# EAGLE design JACK_DUAL_M2 (EAGLE 9.6.2)
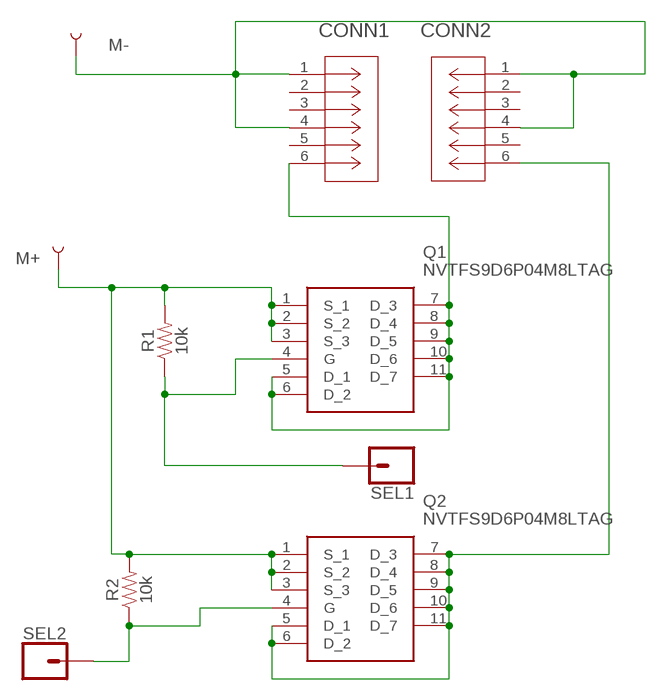
[diagram p0: schematic, sheet 1]

## Parts
CONN1  ACJS-MHDR  [CONN_MHDR_AMP]
CONN2  ACJS-MHDR  [CONN_MHDR_AMP]
M+  TEST-POINT3  [PAD.03X.03]
M-  TEST-POINT3  [PAD.03X.03]
Q1  NVTFS9D6P04M8LTAG  [NVTFS5124PLTWG]
Q2  NVTFS9D6P04M8LTAG  [NVTFS5124PLTWG]
R1  10k  RESISTOR0805  [0805]
R2  10k  RESISTOR0805  [0805]
SEL1  CONN_01  [1X01]
SEL2  CONN_01  [1X01]

## Nets
GND: CONN1.1 CONN1.4 CONN2.1 CONN2.4 M-.P$1
M+: M+.P$1 Q1.1(S_1) Q1.2(S_2) Q1.3(S_3) Q2.1(S_1) Q2.2(S_2) Q2.3(S_3) R1.2 R2.2
M+2: CONN2.6 Q2.5(D_1) Q2.6(D_2) Q2.7(D_3) Q2.8(D_4) Q2.9(D_5) Q2.10(D_6) Q2.11(D_7)
N$1: CONN1.6 Q1.5(D_1) Q1.6(D_2) Q1.7(D_3) Q1.8(D_4) Q1.9(D_5) Q1.10(D_6) Q1.11(D_7)
N$4: Q1.4(G) R1.1 SEL1.1
N$7: Q2.4(G) R2.1 SEL2.1
Unconnected: CONN1.2 CONN1.3 CONN1.5 CONN2.2 CONN2.3 CONN2.5

## Library data of the parts
CONN1 CONN2 = ACJSMHDR:ACJS-MHDR; BUILT_BY: EMA_Matt; COPYRIGHT: Copyright (C) 2018 Accelerated Designs. All rights reserved; MANUFACTURER_PART_NUMBER: ACJS-MHDR; SOURCELIBRARY: Amphenol_2019-10-30; VENDOR: Amphenol
M+ M- = SparkFun-Connectors:TEST-POINT: SparkFun Test Points Bare copper test points for troubleshooting or In-Circuit-Testing. These are used by our Production team for verifying production board runs using pogo-pins on test beds. SparkFun Products: SparkFun LSM9DS1 Breakout <https://www.sparkfun.com/products/13284> SparkFun PSOC <https://www.sparkfun.com/products/13714> SparkFun Load Cell Amplifier <https://www.sparkfun.com/products/13879>
Q1 Q2 = SamacSys_Parts:NVTFS9D6P04M8LTAG: MOSFET MV8 P INITIAL PROGRAM Source: Datasheet <https://www.onsemi.com/pub/Collateral/NVTFS9D6P04M8L-D.PDF>; DESCRIPTION: MOSFET MV8 P INITIAL PROGRAM; HEIGHT: 0.8mm; MANUFACTURER_NAME: ON Semiconductor; MANUFACTURER_PART_NUMBER: NVTFS9D6P04M8LTAG; MOUSER_PART_NUMBER: 863-NVTFS9D6P04M8LTG; MOUSER_PRICE-STOCK: https://www.mouser.co.uk/ProductDetail/ON-Semiconductor/NVTFS9D6P04M8LTAG/?qs=xZ%2FP%252Ba9zWqYALd8g5rll2Q%3D%3D
R1 R2 = SparkFun-Resistors:RESISTOR: Generic Resistor Package
SEL1 SEL2 = SparkFun-Connectors:CONN_01: Single connection point. Often used as Generic Header-pin footprint for 0.1 inch spaced/style header connections On any of the 0.1 inch spaced packages, you can populate with these: Break Away Headers - Straight <https://www.sparkfun.com/products/116> (PRT-00116) Break Away Male Headers - Right Angle <https://www.sparkfun.com/products/553> (PRT-00553) Female Headers <https://www.sparkfun.com/products/115> (PRT-00115) Break Away Headers - Machine Pin <https://www.sparkfun.com/products/117> (PRT-00117) Break Away Female Headers - Swiss Machine Pin <https://www.sparkfun.com/products/743> (PRT-00743) This device is also useful as a general connection point to wire up your design to another part of your project. Our various solder wires solder well into these plated through hole pads. Hook-Up Wire - Assortment (Stranded, 22 AWG) <https://www.sparkfun.com/products/11375> (PRT-11375) Hook-Up Wire - Assortment (Solid Core, 22 AWG) <https://www.sparkfun.com/products/11367> (PRT-11367) View the entire wire category on our website here <https://www.sparkfun.com/categories/141> Special notes: SMTSO-256-ET is a "flush mount" nut for a 4-40 screw. We mostly use this on specialty testbeds; it is a nice way to connect hardware to your PCB at an adjustable hieght. Also note, the SNAP packages are for using a snappable style connector. We sell a baggie of snaps and they are also used on two LilyPad designs: Snap Assortment - 30 pack (male and female) <https://www.sparkfun.com/products/11347> (DEV-11347) LilyPad Arduino SimpleSnap <https://www.sparkfun.com/products/10941> (DEV-10941) LilyPad SimpleSnap Protoboard <https://www.sparkfun.com/products/10940> (DEV-10940)

## Board
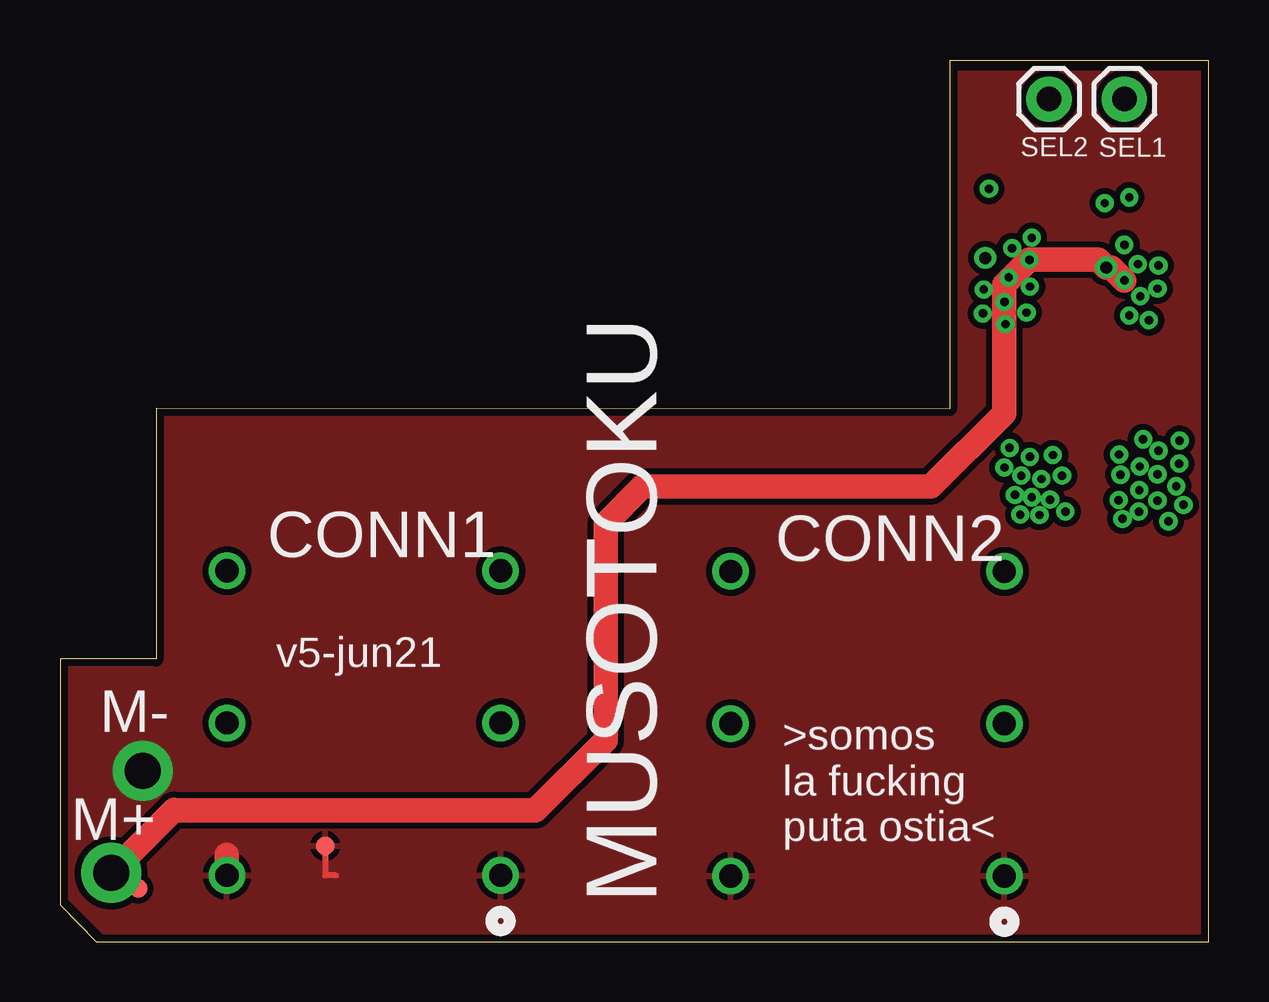
[diagram p1: board, top side]
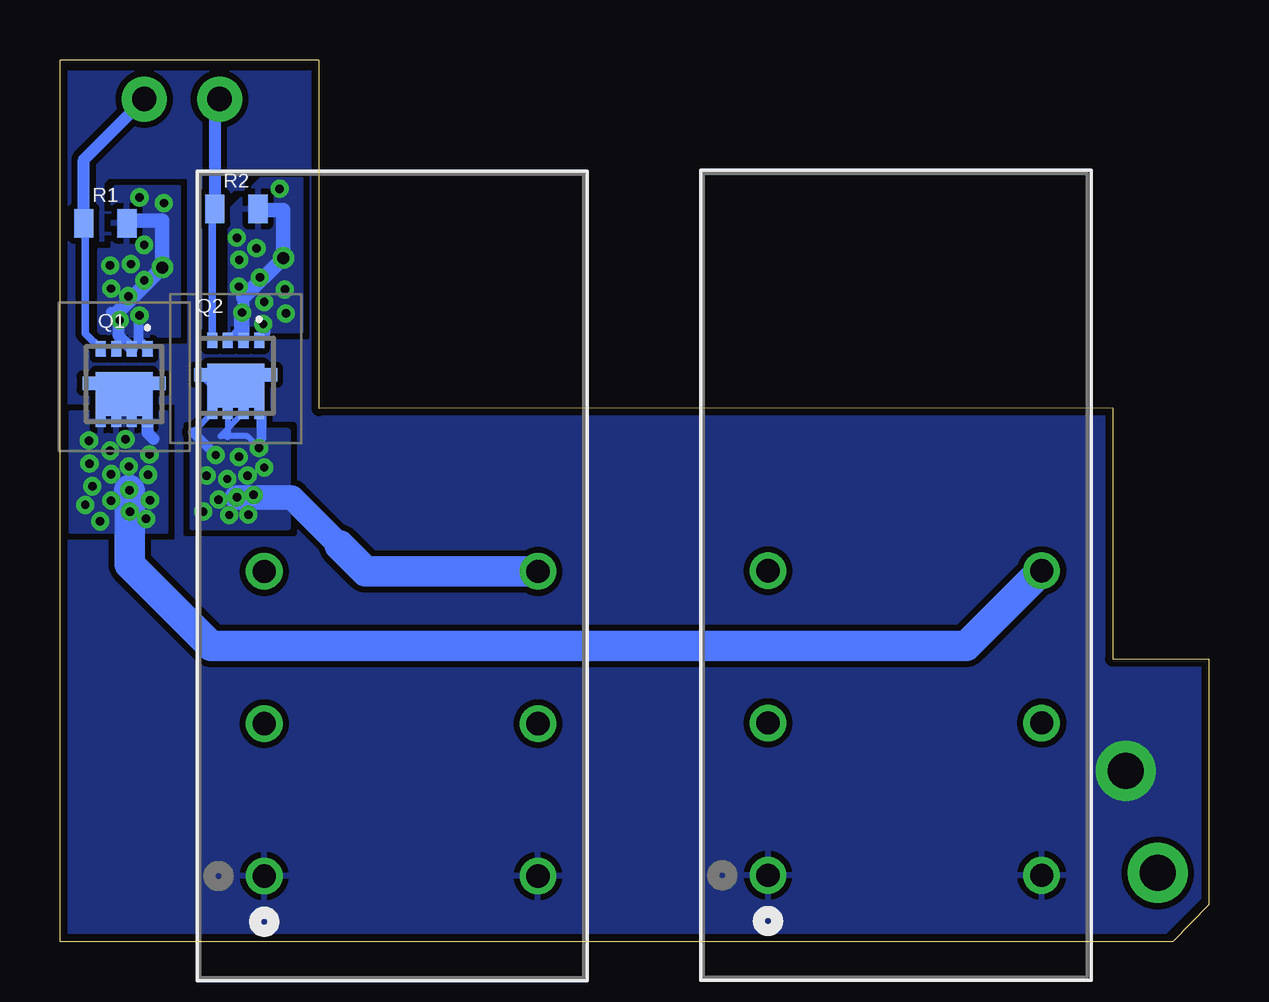
[diagram p2: board, bottom side, seen from below]

Size 47.86 x 36.75 mm. Coordinates in mm from the lower left corner, seen from the top.
Outline: 37.07,36.74 37.07,22.21 4,22.23 4,11.78 0,11.78 0,1.53 1.5,0 47.86,0 47.86,36.75 37.07,36.74
Copper layers (1*16): Top 0.035mm / dielectric 1.5mm / Bottom 0.035mm
Design rules "default *": minimum track width 10mil, minimum drill 0.35mm, track to track 10mil, track to pad 10mil, pad to pad 10mil, via to via 10mil, smd to smd 6mil, copper to edge 12mil, drill to drill 12mil, minimum pad ring 10mil, minimum via ring 8mil, stop-mask expansion 4mil, vias tented up to drill 50mil, thermal gap 10mil

### Footprints (pad centres in the part's own frame; a part is rotated, then mirrored left to right if it is on the bottom)
CONN_MHDR_AMP = drill 0.965 pad 1.524: 1 0,0; 2 -6.35,0; 3 -12.7,0; 4 0,11.405; 5 -6.35,11.405; 6 -12.7,11.405
PAD.03X.03 = smd 0.762 x 0.762: P$1 0,0
NVTFS5124PLTWG = smd 0.42 x 0.66: 1 -0.975,-1.47; 2 -0.325,-1.47; 3 0.325,-1.47; 4 0.975,-1.47 | smd 0.42 x 0.47: 5 0.975,1.565; 6 0.325,1.565; 7 -0.325,1.565; 8 -0.975,1.565 | smd 2.37 x 1.83: 9 0,0.415 | smd 0.545 x 0.57: 10 1.458,-0.035; 11 -1.458,-0.035
0805 = smd 0.8 x 1.2: 1 -0.9,0; 2 0.9,0
1X01 = drill 1.016 pad 1.88: 1 0,0

### Placement (x,y rotation side)
CONN1  18.36,2.76 270 bottom
CONN2  39.35,2.73 270 bottom
M+  3.27,2.21 0 top
M-  11.05,3.98 0 top
Q1  45.19,23.24 180 bottom
Q2  40.54,23.59 180 bottom
R1  45.97,29.94 0 bottom
R2  40.51,30.54 0 bottom
SEL1  44.35,35.12 0 top
SEL2  41.21,35.12 0 top

### Tracks (layer width: path | path; a pad name or v marks a point on that pad's centre or on a via)
GND  (via drill 1.5 pad 2.5)
  Top 0.254: M-.P$1 11.05,2.76 11.5,2.76
  Top 1.016: CONN1.4 6.96,3.62 | CONN2.4 27.94,2.72 | CONN1.1 18.4,2.72
  other vias: 3.45,7.12
  pour Top (isolate 0.254): -0.11,11.63 -0.11,2.24 1.85,0.28 49.53,0.28 49.53,36.26 36.99,36.26 36.99,22.28 4.35,22.28 4.35,11.63
  pour Bottom (isolate 0.254, rank 2): -0.15,11.58 4.35,11.58 4.35,22.28 37.09,22.28 37.09,36.26 47.84,36.26 47.84,0.28 1.85,0.28 -0.15,2.28
M+  (via drill 0.35, 0.5, 1.5 pad 2.5)
  Top 0.254: v2.12,2.86 2.8,2.86 3.27,2.39 M+.P$1
  Top 1.016: v2.12,2.86 4.76,5.49 4.76,5.47 19.81,5.47 22.73,8.39 22.73,17.42 24.27,18.96 36.29,18.96 39.35,22.02 v39.35,26.66 39.35,27.38 v40.39,28.42 43.27,28.42 v43.59,28.1 43.81,28.1 v44.35,27.56
  Bottom 0.254: Q1.3 45.43,24.8 45.43,25.27
  Bottom 0.305: Q2.1 39.26,25.37 39.26,25.61 v39.39,25.74 | Q2.3 40.45,25.48 40.45,26.04 v40.27,26.22
  Bottom 0.406: Q1.1 44.59,25.09 44.59,26.06 v44.55,26.1 | 45.73,26.26 v45.37,25.9
  Bottom 0.508: 40.22,26.84 Q2.2 | 45.43,26.27 45.43,25.27 Q1.2
  Bottom 0.61: R2.2 39.57,30.5 38.55,30.5 v38.55,28.5 40.22,26.84 | 45.43,26.27 v43.59,28.1 43.59,30.06 44.95,30.06 R1.2
  other vias: 38.71,31.38 40.49,29.34 39.67,28.9 40.41,27.3 39.53,27.68 38.49,27.18 38.45,26.18 45.01,26.9 44.35,29.04 45.73,27.22 45.77,28.18 44.91,28.24 43.53,30.78 44.55,31.02
  pour Bottom (isolate 0.254): 37.79,31.8 39.49,31.8 40.81,30.48 40.81,25.42 37.79,25.42
  pour Bottom (isolate 0.254): 42.89,31.46 45.55,31.46 45.69,31.32 45.69,28.84 46.25,28.84 46.25,25.25 42.89,25.25
M+2  (via drill 0.35)
  Bottom 0.254: Q2.5 42.32,21.23 | Q2.7 41.17,21.07 40.06,21.07 v39.57,20.58 | Q2.11 40.09,23.62 Q2.9 | Q2.10 41.55,23.18 Q2.9 | Q2.9 40.87,22.85 Q2.6 40.88,22.01 40.88,21.02
  Bottom 0.406: 39.45,20.98 39.45,21.91 Q2.8 | v41.37,20.28 42.32,21.23
  Bottom 1.016: 36.2,16.51 38.21,18.52 v40.49,18.52
  Bottom 1.27: 36.2,16.51 35.12,15.43 CONN2.6
  other vias: 39.35,19.76 41.75,19.42 41.25,18.42 41.89,17.92 40.81,17.78 40.89,19.28 40.05,19.42 40.41,20.2 39.79,18.62 40.01,17.8
  pour Bottom: 38.35,21.28 42.35,21.28 42.35,17.28 38.35,17.28
N$1  (via drill 0.35)
  Bottom 0.254: Q1.11 44.74,23.27 Q1.9 | Q1.9 45.19,22.24 44.95,22 44.85,21.9 44.85,21.7 Q1.7 | Q1.10 45.64,23.27 Q1.9
  Bottom 0.508: Q1.8 44.21,21.22 43.95,20.95
  Bottom 1.27: CONN1.6 10.09,12.32 41.55,12.32 44.95,15.72 44.95,18.8 v44.97,18.82
  other vias: 44.13,20.3 44.19,19.46 44.11,18.4 44.27,17.62 44.95,17.92 44.99,19.8 45.77,20.46 45.73,19.48 45.73,18.38 46.19,17.52 46.81,18.2 46.51,18.98 46.63,19.92 46.65,20.88 45.13,20.94
  pour Bottom (isolate 0.254): 43.41,22.08 47.43,22.08 47.43,17.08 43.41,17.08 43.41,17.32
N$4
  Bottom 0.305: 46.8,29.88 46.8,25.35 Q1.4
  Bottom 0.508: 46.8,29.88 R1.1 46.87,32.6 SEL1.1
N$7
  Bottom 0.305: R2.1 41.52,30.42 41.52,25.07 Q2.4
  Bottom 0.508: SEL2.1 41.41,34.92 R2.1

### Text on the board
tPlace: v5-jun21 | M- | M+ | >somos / la fucking / puta ostia< | MUSOTOKU